# Altium schematic sheet Sheet2.SchDoc
size A
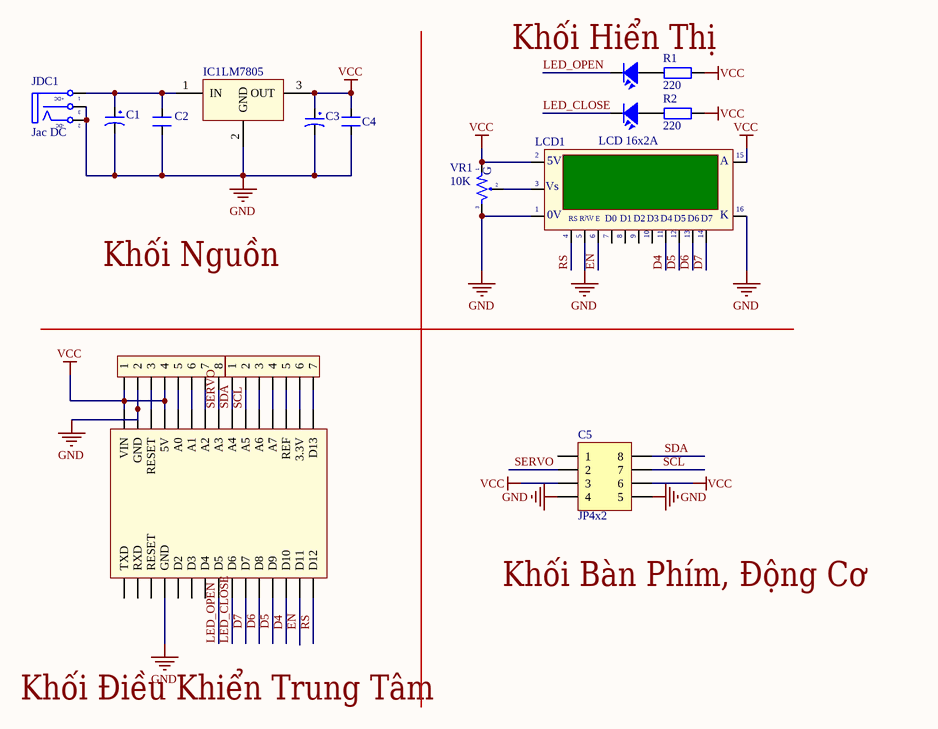
[diagram p0: Sheet2.SchDoc]

## Parts
*1  arduinoNano  [Arduino nano]  (value not drawn)
C1  1000uF/16V  [CP1.5/3.4]  (value not drawn)
C2  100pF  [CN1]  (value not drawn)
C3  1000uF/16V  [CP1.5/3.4]  (value not drawn)
C4  100pF  [CN1]  (value not drawn)
C5  JP4x2  [JP4-D2C]
IC1  LM7805  [QTO-220]
JDC1  Jac DC  [DC-IN]
JP1  JP8 PIN  [JP8]  (value not drawn)
JP2  JP7 PIN  [JP7]  (value not drawn)
LCD1  LCD 16x2A  [LCD16X2N]
LED1  LED  [LED-5-Green]  (value not drawn)
LED2  LED  [LED-5-RED]  (value not drawn)
R1  220  [R1/4W]
R2  220  [R1/4W]
VR1  10K  [VR-S2]

## Nets
GND: *1.4(GND) *1.29(GND) C1.2 C2.1 C3.2 C4.1 C5.4 C5.5 IC1.2(GND) JDC1.2(TN) JDC1.3(S) JP1.2 LCD1.1(GND) LCD1.5(R/~{W}) LCD1.16(K) VR1.3
VCC: *1.27(5V) *1.30(VIN) C3.1 C4.2 C5.3 C5.6 IC1.3(OUT) JP1.1 JP1.4 LCD1.2(VDD) LCD1.15(A) R1.2 R2.2 VR1.1
D4: *1.13(D10) LCD1.11(D4)
D5: *1.12(D9) LCD1.12(D5)
D6: *1.11(D8) LCD1.13(D6)
D7: *1.10(D7) LCD1.14(D7)
EN: *1.14(D11) LCD1.6(~{EN})
LED_CLOSE: *1.9(D6) LED2.2
LED_OPEN: *1.8(D5) LED1.2
RS: *1.15(D12) LCD1.4(RS)
SCL: *1.21(A5) C5.7 JP2.2
SDA: *1.22(A4) C5.8 JP2.1
SERVO: *1.23(A3) C5.2 JP1.8
Net*1_16: *1.16(D13) JP2.7
Net*1_17: *1.17(3.3V) JP2.6
Net*1_18: *1.18(REF) JP2.5
Net*1_19: *1.19(A7) JP2.4
Net*1_20: *1.20(A6) JP2.3
Net*1_24: *1.24(A2) JP1.7
Net*1_25: *1.25(A1) JP1.6
Net*1_26: *1.26(A0) JP1.5
Net*1_28: *1.28(RESET) JP1.3
NetC1_1: C1.1 C2.2 IC1.1(IN) JDC1.1(T)
NetLCD1_3: LCD1.3(VEE) VR1.2
NetLED1_1: LED1.1 R1.1
NetLED2_1: LED2.1 R2.1

Not connected (* = marked no-connect by the designer): *1 1(TXD) 2(RXD) 3(RESET) 5(D2) 6(D3) 7(D4); C5 1; LCD1 7(D0) 8(D1) 9(D2) 10(D3)

## Notes on the sheet
- Labels drawn without touching a wire or pin: Khối Bàn Phím, Động Cơ, Khối Hiển Thị, Khối Nguồn, Khối Điều Khiển Trung Tâm
- (in symbol DCIN) +DC; -DC
- (in symbol LCD16x2A) 5V; Vs; 0V; |; R/W; E
- (in symbol VR-S) G

## Library data of the parts
C1 C3 = CP4: Cap 1000uF/16V - 220uF/50V; Description 5: 4,7uF>10uF/250V_3,3uF>10uF/400V - 2,2uF>4,7uF/450V; Description 1: 2200uF-3300uF/6,3V - 1000uF-2200uF/10V; Description 2: 1000uF/16V - 470uF => 1000uF/25V - 100uF/100V; Description 3: 330uF>470uF/35V_220uF>470uF/50V_10uF>22uF/250V; Description 4: 220uF => 330uF/63V - 10uF =>33uF/160 - 200V; Value: 1000uF/16V
C2 C4 = CN1: Cap np  1pF - 472pF; Value: 100pF
C5 = JP4x2: WR-PHD 2.54 mm Dual Socket Header; Manufacturer: W¨¹rth Elektronik eiSos GmbH; partNo: 61300821821; ComponentLink1 Description: Manufacturer; ComponentLink2 Description: Datasheet; NoPins: 08; Created Date: 29 March 2013; ComponentLink1URL: http://www.we-online.com; ComponentLink2URL: http://katalog.we-online.de/em/datasheet/6130xx21821.pdf; Created by: Karrer Zheng
IC1 = LM78xx: On ap +, from + 5 to + 24VDC; Value: LM7805
JDC1 = DCIN: Jac DC input; Value: Jac DC
JP1 = JP8: Value: JP7
JP2 = JP7: Value: JP7
LCD1 = LCD16x2A: LCD dipslay 16 char, 2 line; Value: LCD16x2A
LED1 LED2 = LED: LED Single colour Green and Red; Value: LED 3 ly Single Colour
R1 R2 = R1/4W: Resistor 1/4W; Value: R1/4W - 1K
VR1 = VR-S: Var Resistor; Value: Volume 50k